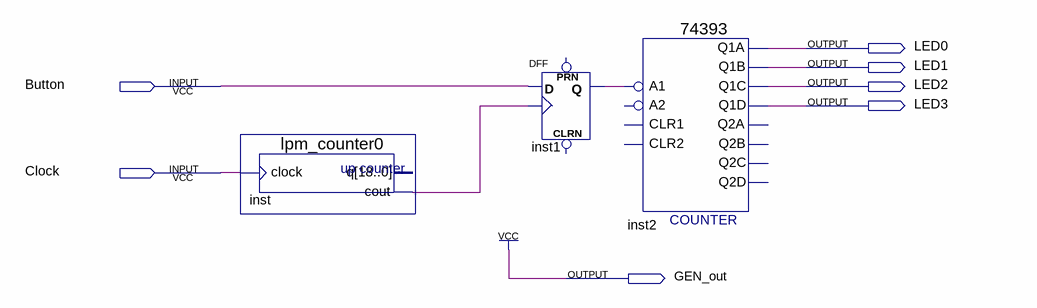
[diagram p0: schematic sheet]
// Quartus schematic lab6_1.bdf as structural Verilog: 3 symbols, 7 pins
module lab6_1 (
  input  Button,
  input  Clock,
  output LED0,
  output LED1,
  output LED2,
  output LED3,
  output GEN_out
);

  wire inst1_q, inst_cout;

  lpm_counter0 inst (.clock(Clock), .cout(inst_cout));  // open: q
  DFF inst1 (.CLK(inst_cout), .D(Button), .Q(inst1_q));  // open: CLRN, PRN
  \74393  inst2 (
    .A1(inst1_q), .Q1C(LED2), .Q1D(LED3), .Q1A(LED0), .Q1B(LED1));  // open: CLR1, A2, CLR2, Q2D, Q2C, Q2B, Q2A

  assign GEN_out = 1'b1;
endmodule
